# Altium schematic sheet GyroAccel.SchDoc
size A; SheetNumber: roneV11-GyroAccel; SheetTotal: 6
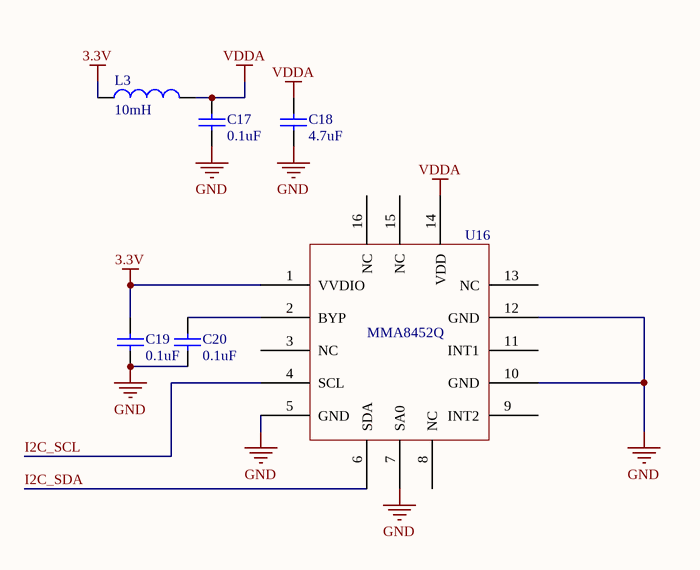
[diagram p0: GyroAccel.SchDoc]

## Parts
C17  value 0.1uF  [CAPC1005L]  (hidden comment: Cap Semi)
C18  value 4.7uF  [CAPC1608L]  (hidden comment: Cap Semi)
C19  value 0.1uF  [CAPC1005L]  (hidden comment: Cap Semi)
C20  value 0.1uF  [CAPC1005L]  (hidden comment: Cap Semi)
L3  value 10mH  [INDC2012L]  (hidden comment: Inductor)
U16  MMA8452Q  [MMA8452Q]

## Nets
3.3V: C19.2 L3.2 U16.1(VVDIO)
GND: C17.1 C18.1 C19.1 C20.1 U16.5(GND) U16.7(SA0) U16.10(GND) U16.12(GND)
VDDA: C17.2 C18.2 L3.1 U16.14(VDD)
I2C_SCL: U16.4(SCL)
I2C_SDA: U16.6(SDA)
NetC20_2: C20.2 U16.2(BYP)

Not connected (* = marked no-connect by the designer): U16 3(NC) 8(NC) 9(INT2) 11(INT1) 13(NC) 15(NC) 16(NC)

## Library data of the parts
C17-C20 = Cap Semi: Capacitor (Semiconductor SIM Model); Published: 8-Jun-2000; LatestRevisionDate: 29-May-2009; LatestRevisionNote: IPC-7351 Footprint Added.; PackageReference: C1206; Publisher: Altium Limited; PackageDescription: Chip Capacitor
L3 = Inductor: Code_IEC: 1005; Published: 8-Jun-2000; LatestRevisionDate: 29-May-2009; LatestRevisionNote: IPC-7351 Footprint Added.; PackageReference: 0402-A; Publisher: Altium Limited; PackageDescription: Chip Inductor; Code_JEITA: 0402